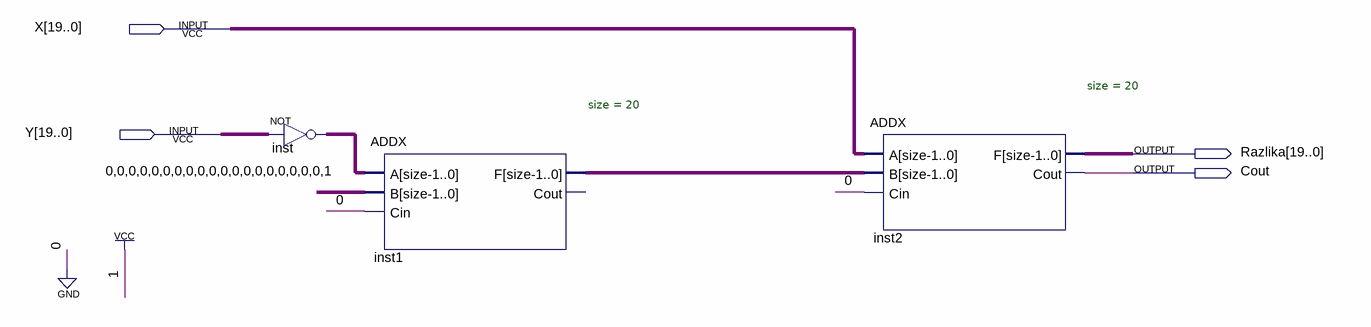
[diagram p0: schematic sheet]
// Quartus schematic SUB20.bdf as structural Verilog: 3 symbols, 4 pins
module SUB20 (
  input  [19:0] X,
  input  [19:0] Y,
  output [19:0] Razlika,
  output Cout
);

  wire [19:0] inst1_f, inst_out;

  assign inst_out = ~Y;  // NOT inst, 20 bits wide
  ADDX #(.size(20)) inst1 (.A(inst_out), .B(20'b00000000000000000001), .Cin(1'b0), .F(inst1_f));  // open: Cout
  ADDX #(.size(20)) inst2 (.A(X), .B(inst1_f), .Cin(1'b0), .F(Razlika), .Cout(Cout));
endmodule
